# Altium schematic sheet 18_HD4_PUMP_2.SchDoc
size 420 x 297 mm; SheetNumber: 30; SheetTotal: 36
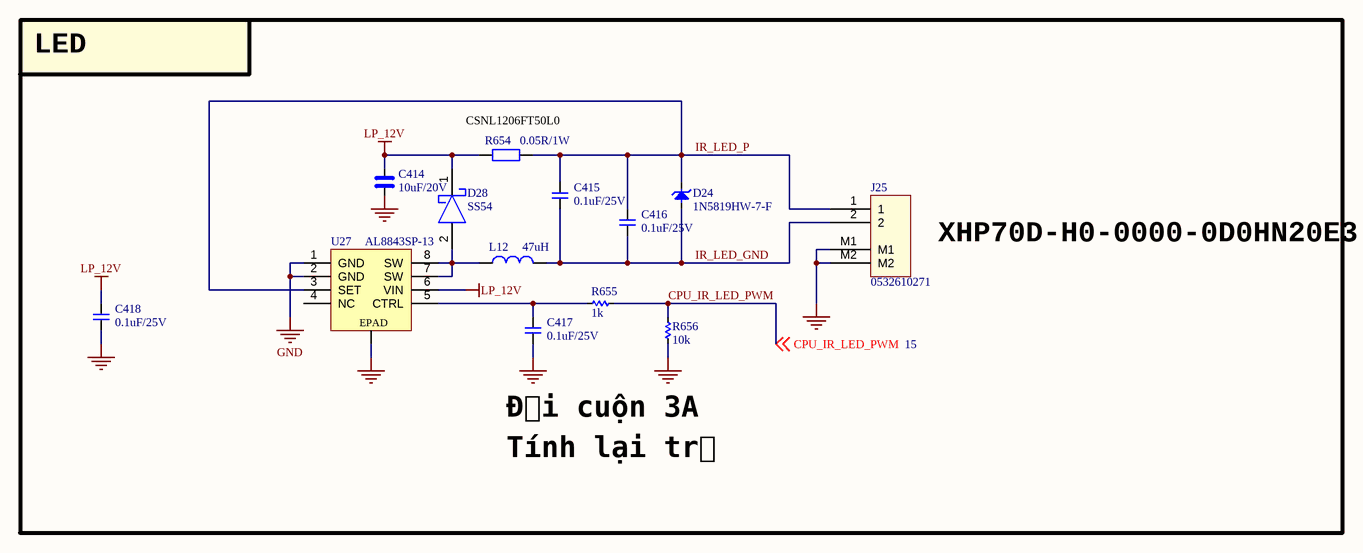
[diagram p0: 18_HD4_PUMP_2.SchDoc]

## Parts
C414  10uF/20V  [CAP_C_2012X110]
C415  0.1uF/25V  [CAP_C_1608X80]
C416  0.1uF/25V  [CAP_C_1608X80]
C417  0.1uF/25V  [CAP_C_1608X80]
C418  0.1uF/25V  [CAP_C_1608X80]
D24  1N5819HW-7-F  [SOD3717X145N]
D28  SS54  [DO-214AC_SMA]
J25  0532610271  [MOLEX_5040500291]
L12  47uH  [IND_MP_1250x1250x850]
R654  0.05R/1W  [RES_C_3216X70]
R655  1k  [RES_C_1608X60]
R656  10k  [RES_C_1608X60]
U27  AL8843SP-13  [SOIC127P602X173-8N_EPAD]

## Nets
GND: C414.2 C417.1 C418.1 J25.M1 J25.M2 R656.2 U27.1(GND) U27.2(GND) U27.9(EPAD)
LP_12V: C414.1 C418.2 D28.1 R654.1 U27.6(VIN)
CPU_IR_LED_PWM: R655.2 R656.1 ; off-sheet CPU_IR_LED_PWM
IR_LED_GND: C415.1 C416.1 D24.2(A) J25.2 L12.2
IR_LED_P: C415.2 C416.2 D24.1(K) J25.1 R654.2 U27.3(SET)
NetC417_2: C417.2 R655.1 U27.5(CTRL)
NetD28_2: D28.2 L12.1 U27.7(SW) U27.8(SW)

Not connected (* = marked no-connect by the designer): U27 4(NC)

## Notes on the sheet
- LED
- (near R654) CSNL1206FT50L0
- XHP70D-H0-0000-0D0HN20E3
- Đổi cuộn 3A
- Tính lại trở
- Project:
- Sub-system:
- Design by:
- Sheet title:
- Sheet
- of
- Checked by:
- Approved by:
- Revision:
- Document No:
- Size:
- Date:
- A3

## Library data of the parts
C414 = _CAP_C_High_2: CAP High Value
C415-C418 = _CAP_C_2: CAP
D24 = DIODE Zener: Zenner
D28 = SS54: DIODE SCHOTTKY 60V 3A DO214AA
J25 = Header 2x1_2M
L12 = L-SMD-1: B82477P4473M000; partNo: 78477010; Manufacturer: Wurth Elektronik; Inductance: 1.0 μH; ComponentLink1Description: Manufacturer; ComponentLink1URL: http://www.we-online.de; Created by: Baojun Chen; Created Date: Nov.2015; ComponentLink2Description: Datasheet; ComponentLink2URL: http://katalog.we-online.de/pbs/datasheet/78477010.pdf
R654 = _RES: RES; Chung_Loai: Dán; Don_Vi: Con; So_Chan: 2; Ten_Linh_Kien: Trở 0603 1% 10k; Ma_Hang: MH006333; Kieu_Chan: *
R655 R656 = _RES_B_2: RES
U27 = AL8843SP-13: IC LED DRIVER RGLTR PWM 3A 8SO